# Altium project LightSensors.PrjPcb
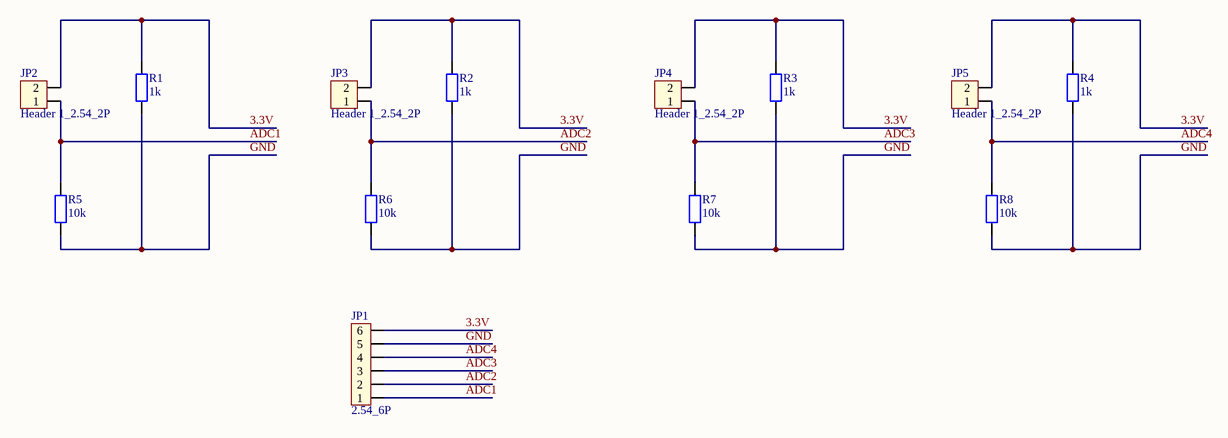
[diagram p0: LightSensors_SCH.SchDoc]
1 sheet, 13 parts. Net scope: global (net labels, ports and power ports of the same name join across sheets).
Board file: LightSensors_PCB.PcbDoc

## Sheet LightSensors_SCH.SchDoc
size A

### Parts
JP1  2.54_6P  [JP6]
JP2  Header 1_2.54_2P  [Header_Duc Cong_2P 2.54]
JP3  Header 1_2.54_2P  [Header_Duc Cong_2P 2.54]
JP4  Header 1_2.54_2P  [Header_Duc Cong_2P 2.54]
JP5  Header 1_2.54_2P  [Header_Duc Cong_2P 2.54]
R1  1k  [tro vach 1/4w]
R2  1k  [tro vach 1/4w]
R3  1k  [tro vach 1/4w]
R4  1k  [tro vach 1/4w]
R5  10k  [tro vach 1/4w]
R6  10k  [tro vach 1/4w]
R7  10k  [tro vach 1/4w]
R8  10k  [tro vach 1/4w]

### Nets
3.3V: JP1.6 JP2.2 JP3.2 JP4.2 JP5.2 R1.2 R2.2 R3.2 R4.2
ADC1: JP1.1 JP2.1 R5.2
ADC2: JP1.2 JP3.1 R6.2
ADC3: JP1.3 JP4.1 R7.2
ADC4: JP1.4 JP5.1 R8.2
GND: JP1.5 R1.1 R2.1 R3.1 R4.1 R5.1 R6.1 R7.1 R8.1

### Library data of the parts
JP1 = Jum Don Duc 2.54_6P: Cắm; Ten_Linh_Kien: Jump Đơn Đực 2.54MM 1x40P Thẳng 11MM; Ma_Hang: MH000903; Don_Vi: Con; Kieu_Chan: *; Ghi_Chu: *; Chung_Loai: Cắm
JP2-JP5 = Header 1_2.54_2P: Cắm; Chung_Loai: Cắm
R1-R4 = Tro Vach 1/4W 5% 1k: Cắm; Don_Vi: Con; So_Chan: 2; Ten_Linh_Kien: Trở Vạch 1/4w 5% 1k; Ma_Hang: MH007390; Chung_Loai: Cắm; Kieu_Chan: *
R5-R8 = Tro Vach 1/4W 5% 10k: Căm; Chung_Loai: Cắm; Don_Vi: Con; So_Chan: 2; Ten_Linh_Kien: Trở Vạch 1/4w 5% 10K; Ma_Hang: MH007354; Kieu_Chan: *